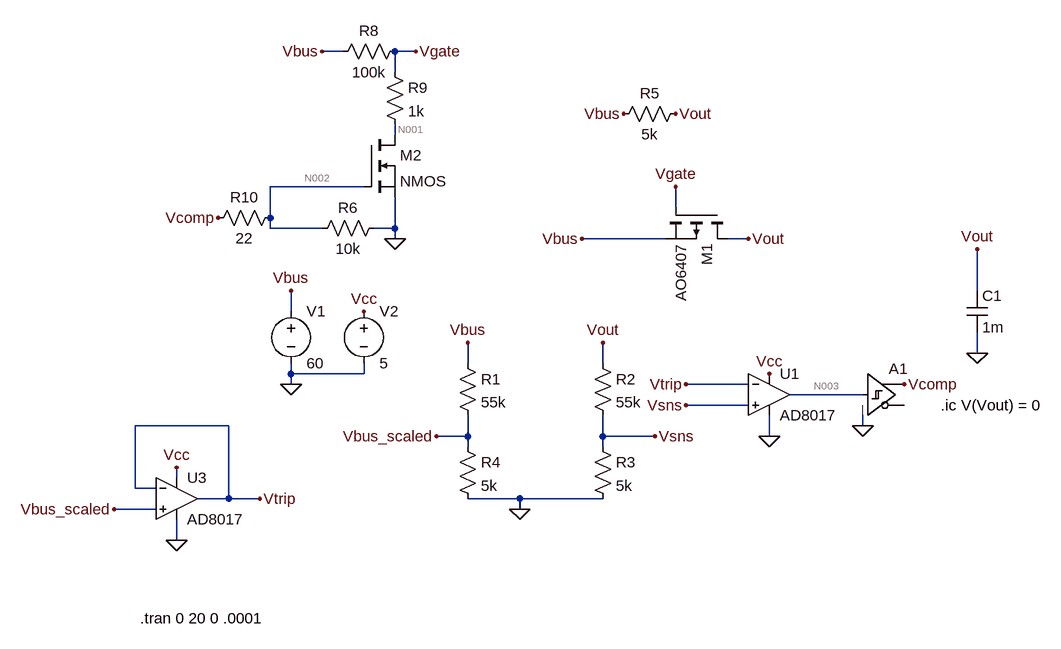
[diagram p0: schematic HW_precharge.asc]
HW_precharge.asc, the LTspice schematic file:
Version 4.1
SHEET 1 1440 724
WIRE 96 -224 64 -224
WIRE 208 -224 176 -224
WIRE 176 -192 176 -224
WIRE 176 -96 176 -112
WIRE 128 -16 -16 -16
WIRE 608 16 608 -16
WIRE -16 32 -16 -16
WIRE -16 48 -16 32
WIRE 64 48 -16 48
WIRE 176 48 176 0
WIRE 176 48 144 48
WIRE 176 64 176 48
WIRE 592 64 464 64
WIRE 720 64 688 64
WIRE 1072 144 1072 80
WIRE 16 176 16 144
WIRE 1072 240 1072 208
WIRE 288 256 288 224
WIRE 496 256 496 224
WIRE 16 272 16 256
WIRE 128 272 128 256
WIRE 128 272 16 272
WIRE 16 288 16 272
WIRE 720 288 624 288
WIRE 896 304 784 304
WIRE 720 320 624 320
WIRE -80 352 -224 352
WIRE 896 352 896 336
WIRE 288 368 288 336
WIRE 288 368 240 368
WIRE 496 368 496 336
WIRE 576 368 496 368
WIRE 752 368 752 336
WIRE 288 384 288 368
WIRE 496 384 496 368
WIRE -160 432 -160 416
WIRE -224 448 -224 352
WIRE -192 448 -224 448
WIRE -80 464 -80 352
WIRE -80 464 -128 464
WIRE -32 464 -80 464
WIRE 368 464 288 464
WIRE 496 464 368 464
WIRE -192 480 -256 480
WIRE 368 480 368 464
WIRE -160 528 -160 496
FLAG 16 288 0
FLAG 16 144 Vbus
FLAG 128 176 Vcc
FLAG 1072 240 0
FLAG 1072 80 Vout
FLAG 608 -16 Vgate
FLAG 720 64 Vout
FLAG 464 64 Vbus
FLAG 288 224 Vbus
FLAG 496 224 Vout
FLAG 528 -128 Vbus
FLAG 608 -128 Vout
FLAG 368 480 0
FLAG 240 368 Vbus_scaled
FLAG 576 368 Vsns
FLAG 752 272 Vcc
FLAG 960 288 Vcomp
FLAG 64 -224 Vbus
FLAG 176 64 0
FLAG -96 32 Vcomp
FLAG 208 -224 Vgate
FLAG -160 416 Vcc
FLAG -32 464 Vtrip
FLAG -256 480 Vbus_scaled
FLAG 624 320 Vsns
FLAG 624 288 Vtrip
FLAG 752 368 0
FLAG 896 352 0
FLAG -160 528 0
SYMBOL voltage 16 160 R0
WINDOW 123 0 0 Left 0
WINDOW 39 0 0 Left 0
SYMATTR InstName V1
SYMATTR Value 60
SYMBOL voltage 128 160 R0
WINDOW 123 0 0 Left 0
WINDOW 39 0 0 Left 0
SYMATTR InstName V2
SYMATTR Value 5
SYMBOL cap 1056 144 R0
SYMATTR InstName C1
SYMATTR Value 1m
SYMBOL pmos 688 16 R90
SYMATTR InstName M1
SYMATTR Value AO6407
SYMBOL res 272 240 R0
SYMATTR InstName R1
SYMATTR Value 55k
SYMBOL res 480 240 R0
SYMATTR InstName R2
SYMATTR Value 55k
SYMBOL res 480 368 R0
SYMATTR InstName R3
SYMATTR Value 5k
SYMBOL res 272 368 R0
SYMATTR InstName R4
SYMATTR Value 5k
SYMBOL res 624 -144 R90
WINDOW 0 0 56 VBottom 2
WINDOW 3 32 56 VTop 2
SYMATTR InstName R5
SYMATTR Value 5k
SYMBOL res 192 -240 R90
WINDOW 0 0 56 VBottom 2
WINDOW 3 32 56 VTop 2
SYMATTR InstName R8
SYMATTR Value 100k
SYMBOL res 160 -208 R0
SYMATTR InstName R9
SYMATTR Value 1k
SYMBOL res 0 16 R90
WINDOW 0 0 56 VBottom 2
WINDOW 3 32 56 VTop 2
SYMATTR InstName R10
SYMATTR Value 22
SYMBOL nmos 128 -96 R0
SYMATTR InstName M2
SYMBOL OpAmps\\AD8017 -160 400 R0
SYMATTR InstName U3
SYMBOL res 160 32 R90
WINDOW 0 0 56 VBottom 2
WINDOW 3 32 56 VTop 2
SYMATTR InstName R6
SYMATTR Value 10k
SYMBOL OpAmps\\AD8017 752 240 R0
SYMATTR InstName U1
SYMBOL Digital\\schmitt 896 240 R0
SYMATTR InstName A1
TEXT -216 648 Left 2 !.tran 0 20 0 .0001
TEXT 1016 320 Left 2 !.ic V(Vout) = 0

The netlist it stands for:
* HW_precharge.asc
V1 Vbus 0 60
V2 Vcc 0 5
C1 Vout 0 1m
M1 Vout Vgate Vbus Vbus AO6407
R1 Vbus Vbus_scaled 55k
R2 Vout Vsns 55k
R3 Vsns 0 5k
R4 Vbus_scaled 0 5k
R5 Vout Vbus 5k
R8 Vgate Vbus 100k
R9 Vgate N001 1k
R10 N002 Vcomp 22
M2 N001 N002 0 0 NMOS
X§U3 Vbus_scaled Vtrip Vcc 0 Vtrip AD8017  ; pins In+ In- V+ V- OUT
R6 0 N002 10k
X§U1 Vsns Vtrip Vcc 0 N003 AD8017  ; pins In+ In- V+ V- OUT
A1 N003 0 0 0 0 0 Vcomp 0 SCHMITT
.model NMOS NMOS
.model PMOS PMOS
.lib standard.mos
.tran 0 20 0 .0001
.ic V(Vout) = 0
.backanno
.end

* Results of the author's LTspice run, read from the files saved beside the schematic
* Operating Point, zero values left out:
*   V(vcc) = 5 V
*   V(vgate) = 59 V
*   V(vbus_scaled) = 4.25 V
*   V(n001) = 58.99 V
*   V(vtrip) = 4.084 V
*   V(vbus) = 60 V
*   V(vsns) = 782.4 mV
*   V(n002) = 997.7 mV
*   V(vcomp) = 999.9 mV
*   V(n003) = 901.4 mV
*   I(V1) = -671.9 mA
*   I(R2) = -14.22 µA
*   I(R4) = 849.9 µA
*   I(R9) = 9.954 µA
*   I(R1) = 1.014 mA
*   Id(M2) = 9.954 µA
*   Is(M2) = -9.954 µA
*   Ib(M2) = -59 pA
*   I8(A1) = 99.77 µA
*   I7(A1) = -99.77 µA
*   Id(M1) = -658.9 mA
*   Is(M1) = 658.9 mA
*   I(R3) = 156.5 µA
*   I(R5) = -12 mA
*   I(R8) = -9.954 µA
*   I(R10) = -99.77 µA
*   I(R6) = -99.77 µA
*   I(V2) = -26.47 mA
*   Ix(u1:1) = -170.7 µA
*   Ix(u1:2) = 36.63 mA
*   Ix(u1:99) = 6.485 mA
*   Ix(u1:50) = -6.484 mA
*   Ix(u3:1) = 163.7 µA
*   Ix(u3:2) = -23.09 mA
*   Ix(u3:99) = 19.99 mA
*   Ix(u3:50) = -6.485 mA
*   Ix(u3:61) = -13.54 mA
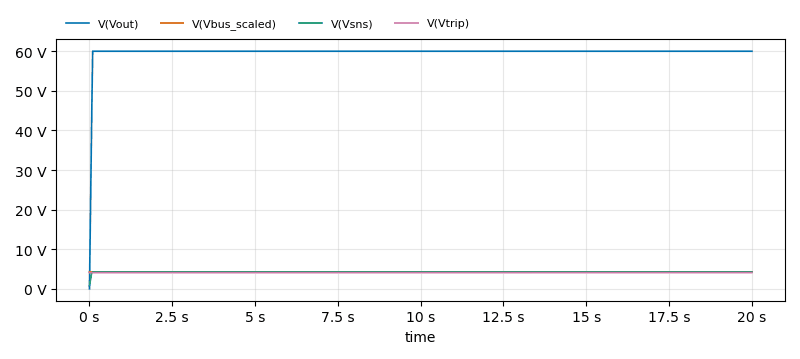
[diagram p1: Transient Analysis of HW_precharge.asc, plotted from the saved traces]
* Transient Analysis, 1 run:
*   V(Vout): min 0 V, max 60 V, average 59.86 V, rms 59.91 V, last 60 V
*   V(Vbus_scaled): min 4.25 V, max 4.259 V, average 4.259 V, rms 4.259 V, last 4.259 V
*   V(Vsns): min 782.4 mV, max 4.259 V, average 4.253 V, rms 4.254 V, last 4.259 V
*   V(Vtrip): min 4.084 V, max 4.095 V, average 4.095 V, rms 4.095 V, last 4.095 V